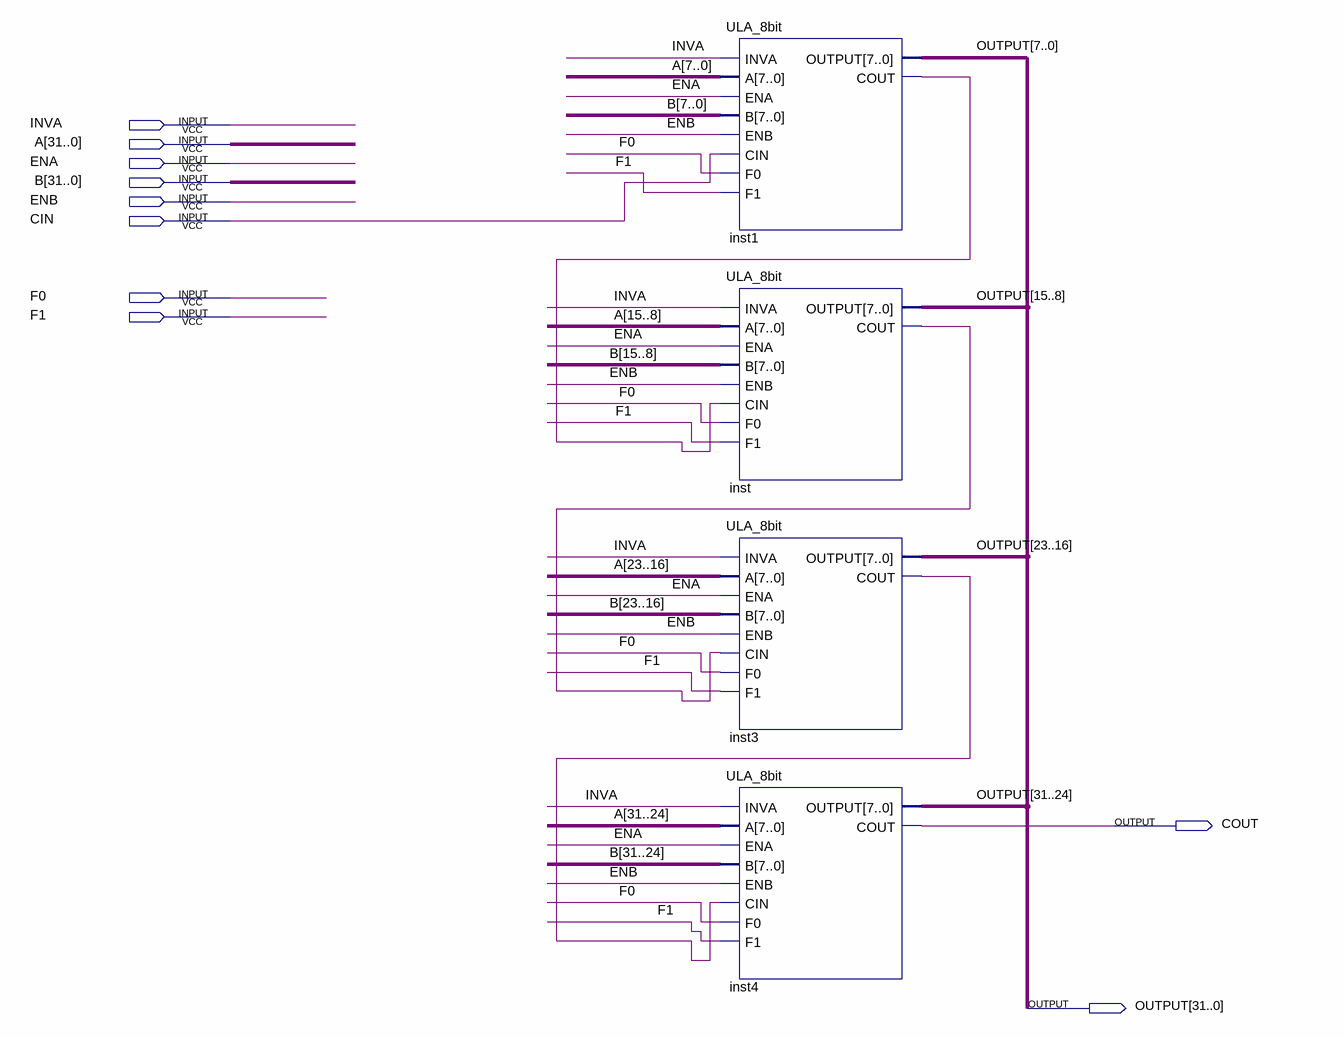
[diagram p0: schematic sheet]
// Quartus schematic ULA_32bit.bdf as structural Verilog: 4 symbols, 10 pins
module ULA_32bit (
  input  INVA,
  input  [31:0] A,
  input  ENA,
  input  [31:0] B,
  input  ENB,
  input  CIN,
  input  F0,
  input  F1,
  output COUT,
  output [31:0] OUTPUT
);

  wire inst1_cout, inst3_cout, inst_cout;

  ULA_8bit inst1 (
    .INVA(INVA), .A(A[7:0]), .ENA(ENA), .B(B[7:0]), .ENB(ENB), .CIN(CIN), .F0(F0), .F1(F1),
    .OUTPUT(OUTPUT[7:0]), .COUT(inst1_cout));
  ULA_8bit inst (
    .INVA(INVA), .A(A[15:8]), .ENA(ENA), .B(B[15:8]), .ENB(ENB), .CIN(inst1_cout), .F0(F0), .F1(F1),
    .OUTPUT(OUTPUT[15:8]), .COUT(inst_cout));
  ULA_8bit inst3 (
    .INVA(INVA), .A(A[23:16]), .ENA(ENA), .B(B[23:16]), .ENB(ENB), .CIN(inst_cout), .F0(F0), .F1(F1),
    .OUTPUT(OUTPUT[23:16]), .COUT(inst3_cout));
  ULA_8bit inst4 (
    .INVA(INVA), .A(A[31:24]), .ENA(ENA), .B(B[31:24]), .ENB(ENB), .CIN(inst3_cout), .F0(F0), .F1(F1),
    .OUTPUT(OUTPUT[31:24]), .COUT(COUT));
endmodule
